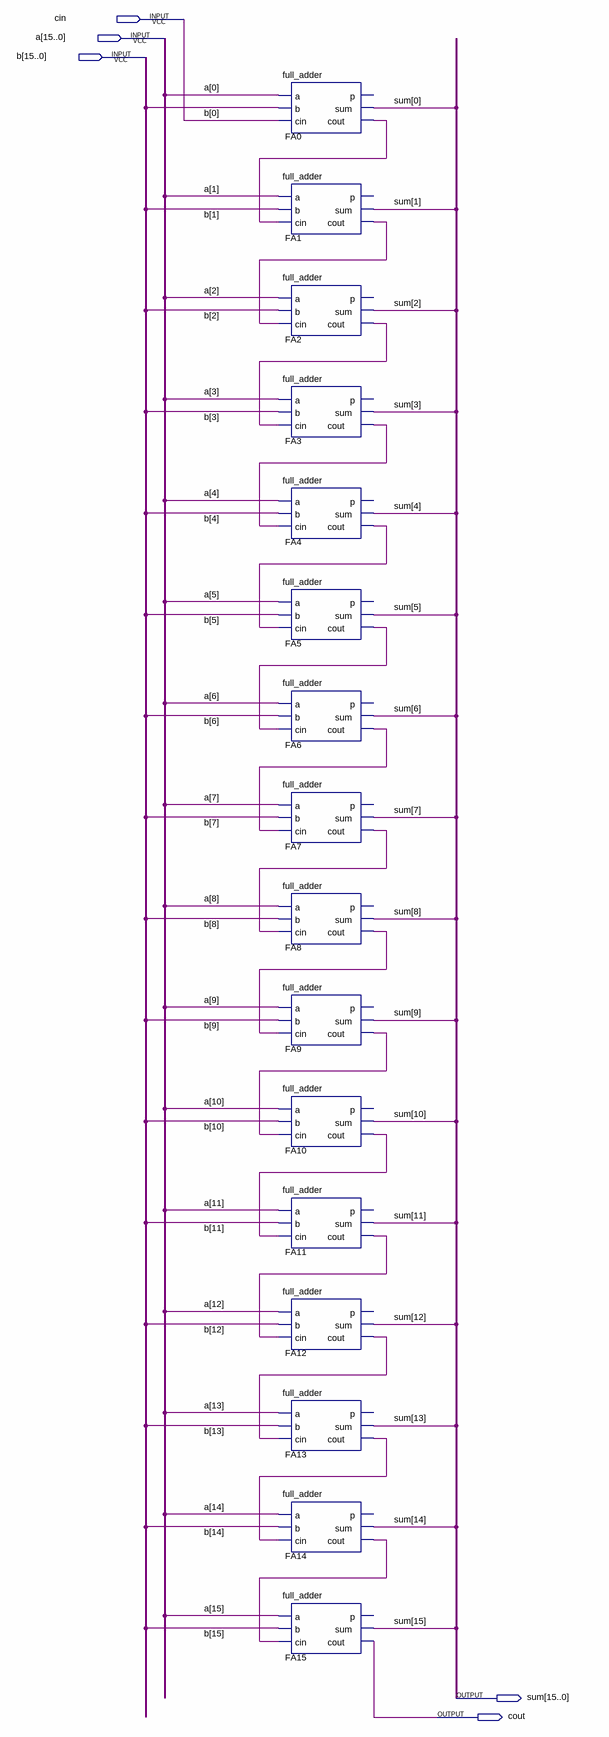
[diagram p0: schematic sheet]
// Quartus schematic adder.bdf as structural Verilog: 16 symbols, 5 pins
module adder (
  input  cin,
  input  [15:0] a,
  input  [15:0] b,
  output [15:0] sum,
  output cout
);

  wire FA0_cout, FA1_cout, FA2_cout, FA3_cout, FA4_cout, FA5_cout, FA6_cout, FA7_cout, FA8_cout, FA9_cout,
       FA10_cout, FA11_cout, FA12_cout, FA13_cout, FA14_cout;

  full_adder FA0 (.a(a[0]), .b(b[0]), .cin(cin), .sum(sum[0]), .cout(FA0_cout));  // open: p
  full_adder FA1 (.a(a[1]), .b(b[1]), .cin(FA0_cout), .sum(sum[1]), .cout(FA1_cout));  // open: p
  full_adder FA2 (.a(a[2]), .b(b[2]), .cin(FA1_cout), .sum(sum[2]), .cout(FA2_cout));  // open: p
  full_adder FA3 (.a(a[3]), .b(b[3]), .cin(FA2_cout), .sum(sum[3]), .cout(FA3_cout));  // open: p
  full_adder FA4 (.a(a[4]), .b(b[4]), .cin(FA3_cout), .sum(sum[4]), .cout(FA4_cout));  // open: p
  full_adder FA5 (.a(a[5]), .b(b[5]), .cin(FA4_cout), .sum(sum[5]), .cout(FA5_cout));  // open: p
  full_adder FA6 (.a(a[6]), .b(b[6]), .cin(FA5_cout), .sum(sum[6]), .cout(FA6_cout));  // open: p
  full_adder FA7 (.a(a[7]), .b(b[7]), .cin(FA6_cout), .sum(sum[7]), .cout(FA7_cout));  // open: p
  full_adder FA8 (.a(a[8]), .b(b[8]), .cin(FA7_cout), .sum(sum[8]), .cout(FA8_cout));  // open: p
  full_adder FA9 (.a(a[9]), .b(b[9]), .cin(FA8_cout), .sum(sum[9]), .cout(FA9_cout));  // open: p
  full_adder FA10 (.a(a[10]), .b(b[10]), .cin(FA9_cout), .sum(sum[10]), .cout(FA10_cout));  // open: p
  full_adder FA11 (.a(a[11]), .b(b[11]), .cin(FA10_cout), .sum(sum[11]), .cout(FA11_cout));  // open: p
  full_adder FA12 (.a(a[12]), .b(b[12]), .cin(FA11_cout), .sum(sum[12]), .cout(FA12_cout));  // open: p
  full_adder FA13 (.a(a[13]), .b(b[13]), .cin(FA12_cout), .sum(sum[13]), .cout(FA13_cout));  // open: p
  full_adder FA14 (.a(a[14]), .b(b[14]), .cin(FA13_cout), .sum(sum[14]), .cout(FA14_cout));  // open: p
  full_adder FA15 (.a(a[15]), .b(b[15]), .cin(FA14_cout), .sum(sum[15]), .cout(cout));  // open: p
endmodule
